# EAGLE schematic D1-Nixi-6csöves-z573m-V2 (EAGLE 6.3)
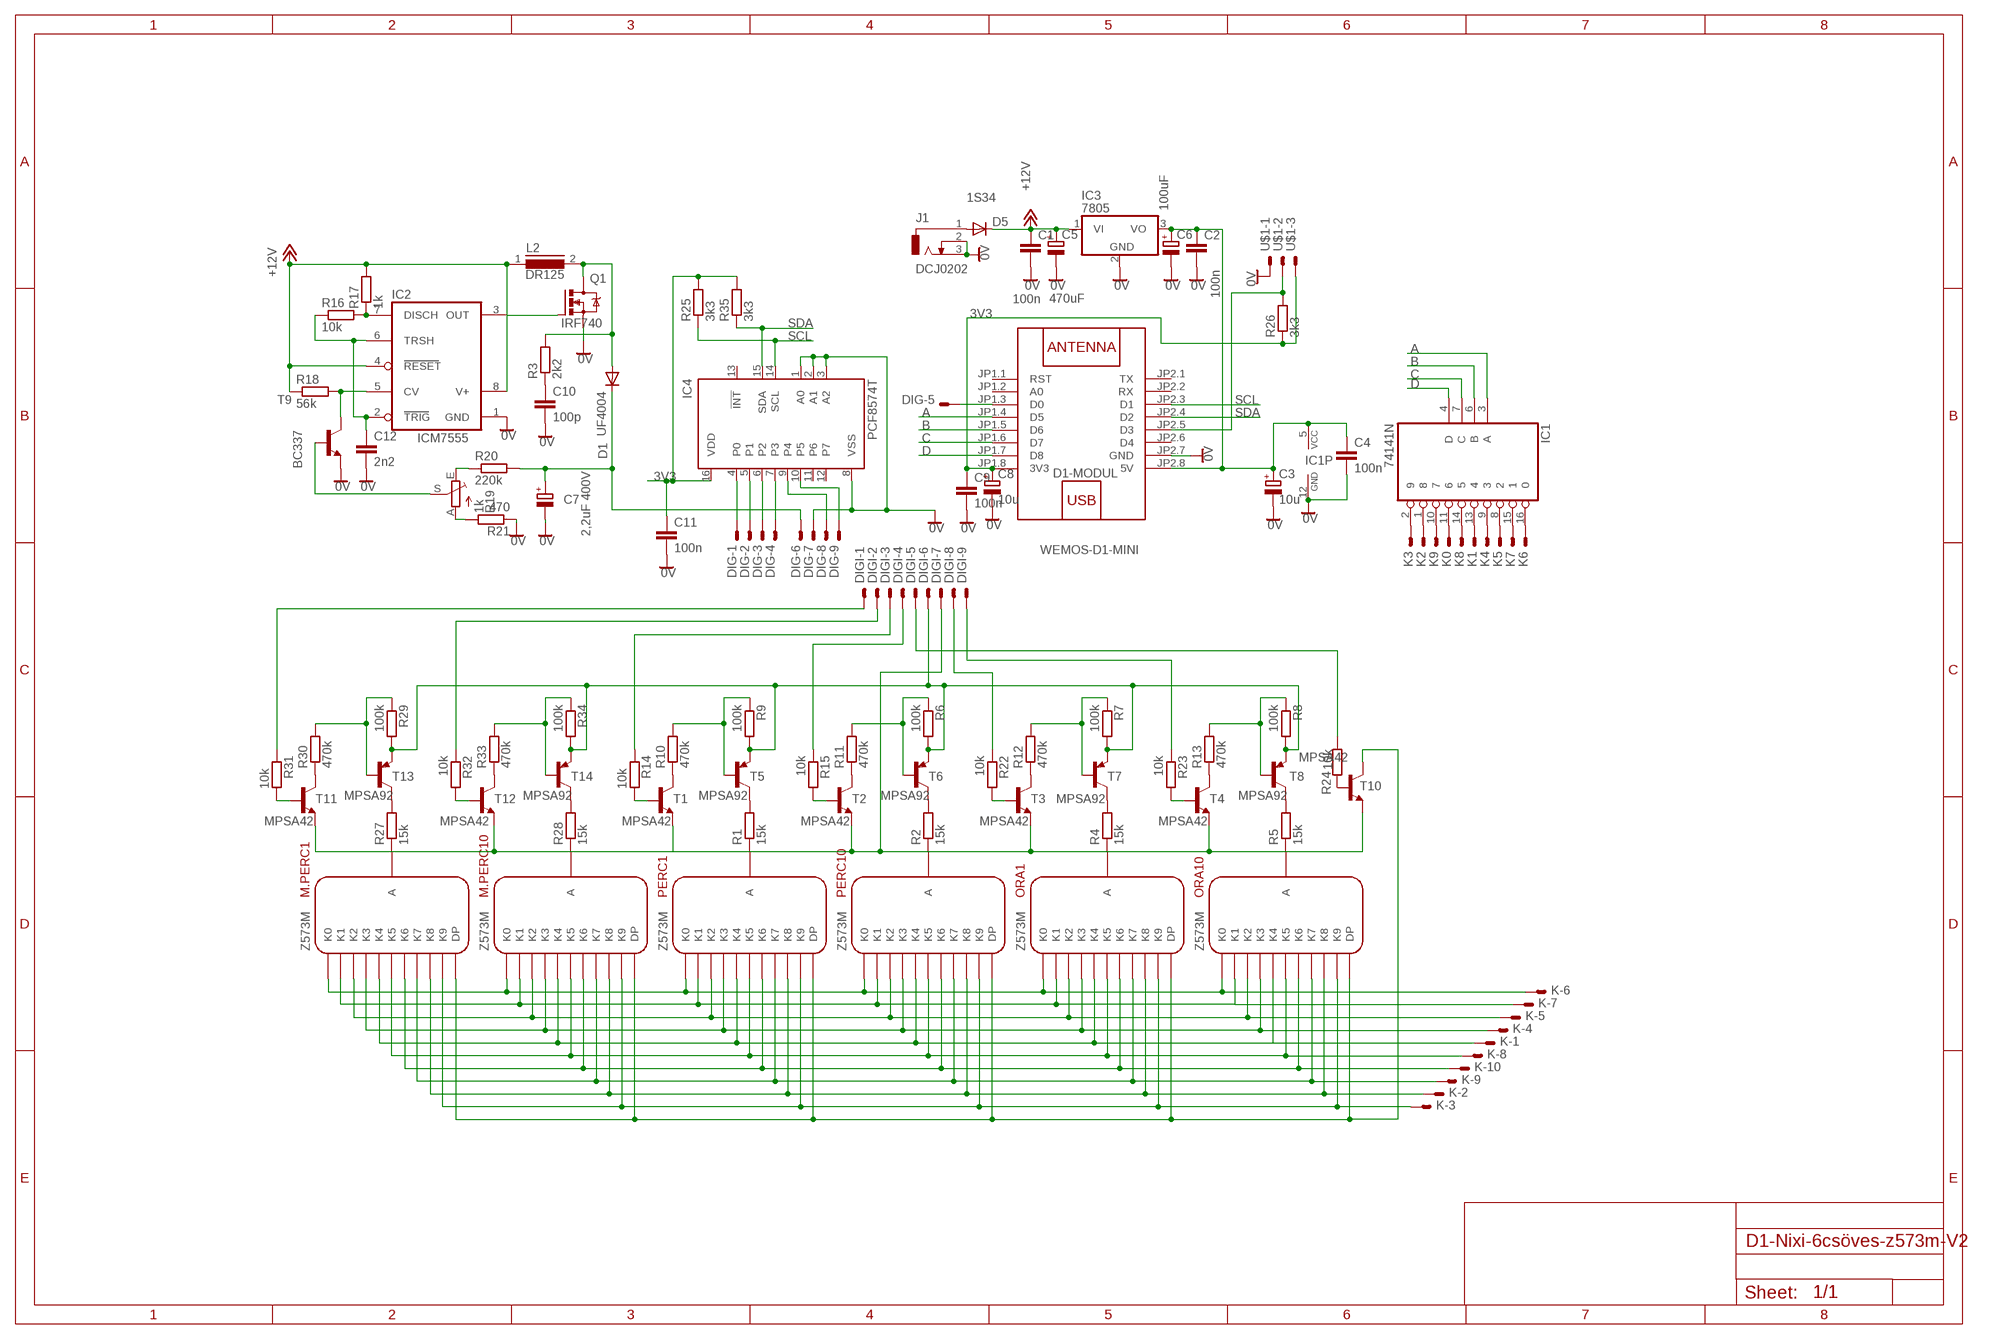
[diagram p0: schematic, sheet 1]

## Parts
C1  100n  C-EUC0603  [C0603]
C2  100n  C-EUC0603  [C0603]
C3  10u  CPOL-EUE2,5-6E  [E2,5-6E]
C4  100n  C-EUC0603  [C0603]
C5  470uF  CPOL-EUE5-10.5  [E5-10,5]
C6  100uF  CPOL-EUE3.5-8  [E3,5-8]
C7  2,2uF 400V  CPOL-EUE3.5-8  [E3,5-8]
C8  10u  CPOL-EUE2,5-6E  [E2,5-6E]
C9  100n  C-EUC0603  [C0603]
C10  100p  C-EU050-024X044  [C050-024X044]
C11  100n  C-EUC0603  [C0603]
C12  2n2  C-EUC0603  [C0603]
D1  UF4004  BA221  [DO35-10]
D1-MODUL  WEMOS-D1-MINI  [WEMOS-D1-MINI]
D5  1S34  DIODE-DO214AA  [DO214AA]
DIG  PAD9  [PAD9]
DIGI  PAD9  [PAD9]
IC1  74141N  [DIL16]
IC2  ICM7555  [DIL08]
IC3  7805  786TV  [TO220V]
IC4  PCF8574T  [SO16W]
J1  DCJ0202  [DCJ0202]
K  PAD25  [PAD25]
K0  PAD1  [PAD1]
K1  PAD1  [PAD1]
K2  PAD1  [PAD1]
K3  PAD1  [PAD1]
K4  PAD1  [PAD1]
K5  PAD1  [PAD1]
K6  PAD1  [PAD1]
K7  PAD1  [PAD1]
K8  PAD1  [PAD1]
K9  PAD1  [PAD1]
L2  DR125  [DR125]
M.PERC1  ora10  Z573SZ1  [Z573SZ1]
M.PERC10  Z573SZ1  [Z573SZ1]
ORA1  Z573SZ1  [Z573SZ1]
ORA10  Z573SZ1  [Z573SZ1]
PERC1  ora10  Z573SZ1  [Z573SZ1]
PERC10  Z573SZ1  [Z573SZ1]
Q1  IRF740  [TO220BV]
R1  15k  R-EU_0207/7  [0207/7]
R2  15k  R-EU_0207/7  [0207/7]
R3  2k2  R-EU_0204/7  [0204/7]
R4  15k  R-EU_0207/7  [0207/7]
R5  15k  R-EU_0207/7  [0207/7]
R6  100k  R-EU_0207/7  [0207/7]
R7  100k  R-EU_0207/7  [0207/7]
R8  100k  R-EU_0207/7  [0207/7]
R9  100k  R-EU_0207/7  [0207/7]
R10  470k  R-EU_0207/7  [0207/7]
R11  470k  R-EU_0207/7  [0207/7]
R12  470k  R-EU_0207/7  [0207/7]
R13  470k  R-EU_0207/7  [0207/7]
R14  10k  R-EU_0207/7  [0207/7]
R15  10k  R-EU_0207/7  [0207/7]
R16  10k  R-EU_R0603  [R0603]
R17  1k  R-EU_R0603  [R0603]
R18  56k  R-EU_R0603  [R0603]
R19  1k  TRIM_EU-CA6H  [CA6H]
R20  220k  R-EU_0204/7  [0204/7]
R21  470  R-EU_0204/7  [0204/7]
R22  10k  R-EU_0207/7  [0207/7]
R23  10k  R-EU_0207/7  [0207/7]
R24  10k  R-EU_0207/7  [0207/7]
R25  3k3  R-EU_R0603  [R0603]
R26  3k3  R-EU_R0603  [R0603]
R27  15k  R-EU_0207/7  [0207/7]
R28  15k  R-EU_0207/7  [0207/7]
R29  100k  R-EU_0207/7  [0207/7]
R30  470k  R-EU_0207/7  [0207/7]
R31  10k  R-EU_0207/7  [0207/7]
R32  10k  R-EU_0207/7  [0207/7]
R33  470k  R-EU_0207/7  [0207/7]
R34  100k  R-EU_0207/7  [0207/7]
R35  3k3  R-EU_R0603  [R0603]
T1  MPSA42  BC317-NPN-TO92-EBC  [TO92-EBC]
T2  MPSA42  BC317-NPN-TO92-EBC  [TO92-EBC]
T3  MPSA42  BC317-NPN-TO92-EBC  [TO92-EBC]
T4  MPSA42  BC317-NPN-TO92-EBC  [TO92-EBC]
T5  MPSA92  BC328-PNP-TO92-EBC  [TO92-EBC]
T6  MPSA92  BC328-PNP-TO92-EBC  [TO92-EBC]
T7  MPSA92  BC328-PNP-TO92-EBC  [TO92-EBC]
T8  MPSA92  BC328-PNP-TO92-EBC  [TO92-EBC]
T9  BC337  BC237-NPN-TO92-CBE  [TO92-CBE]
T10  MPSA42  BC317-NPN-TO92-EBC  [TO92-EBC]
T11  MPSA42  BC317-NPN-TO92-EBC  [TO92-EBC]
T12  MPSA42  BC317-NPN-TO92-EBC  [TO92-EBC]
T13  MPSA92  BC328-PNP-TO92-EBC  [TO92-EBC]
T14  MPSA92  BC328-PNP-TO92-EBC  [TO92-EBC]
U$1  PAD3  [PAD3]

## Nets
0V: C1.2 C2.2 C3.- C4.2 C5.- C6.- C7.- C8.- C9.2 C10.2 C11.2 C12.2 D1-MODUL.JP2.7(GND) DIG.P$7 IC1.12(GND) IC2.1(GND) IC3.2(GND) IC4.1(A0) IC4.2(A1) IC4.3(A2) IC4.8(VSS) J1.2 J1.3 Q1.S R21.1 T9.E U$1.P$1
3V3: C8.+ C9.1 C11.1 D1-MODUL.JP1.8(3V3) IC4.16(VDD) R25.2 R26.1 R35.2 U$1.P$3
+12V: C1.1 C5.+ D5.C IC2.4(RESET) IC2.8(V+) IC3.1(VI) L2.1 R17.2 R18.1
A: D1-MODUL.JP1.4(D5) IC1.3(A)
B: D1-MODUL.JP1.5(D6) IC1.6(B)
C: D1-MODUL.JP1.6(D7) IC1.7(C)
D: D1-MODUL.JP1.7(D8) IC1.4(D)
GND: DIGI.P$7 T1.E T2.E T3.E T4.E T10.E
GND1: T11.E T12.E
N$1: DIG.P$9 IC4.10(P5)
N$2: DIG.P$4 IC4.7(P3)
N$3: DIG.P$8 IC4.9(P4)
N$4: DIG.P$1 IC4.4(P0)
N$5: DIG.P$2 IC4.5(P1)
N$6: DIG.P$3 IC4.6(P2)
N$7: IC1.16 K6.1(S)
N$8: IC1.10 K9.1(S)
N$9: IC1.15 K7.1(S)
N$10: PERC1.A R1.1
N$11: PERC10.A R2.1
N$12: ORA1.A R4.1
N$13: ORA10.A R5.1
N$14: R1.2 T5.C
N$15: R2.2 T6.C
N$16: R4.2 T7.C
N$17: R5.2 T8.C
N$18: R19.E R20.1
N$19: R10.1 T1.C
N$20: R19.A R21.2
N$21: R9.1 R10.2 T5.B
N$22: IC2.3(OUT) Q1.G
N$23: IC2.7(DISCH) R16.2 R17.1
N$24: C12.1 IC2.2(TRIG) IC2.6(TRSH) R16.1
N$25: R6.1 R11.2 T6.B
N$26: IC2.5(CV) R18.2 T9.C
N$27: C10.1 R3.1
N$28: C7.+ D1.C DIG.P$6 R20.2
N$29: R7.1 R12.2 T7.B
N$30: R8.1 R13.2 T8.B
N$31: R11.1 T2.C
N$32: R12.1 T3.C
N$33: R13.1 T4.C
N$34: R14.2 T1.B
N$35: R15.2 T2.B
N$36: R22.2 T3.B
N$37: R23.2 T4.B
N$38: R24.2 T10.B
N$39: DIGI.P$6 R6.2 R7.2 R8.2 R9.2 R29.2 R34.2 T5.E T6.E T7.E T8.E T13.E T14.E
N$40: DIGI.P$3 R14.1
N$41: DIGI.P$4 R15.1
N$42: K.P$6 M.PERC1.K0 M.PERC10.K0 ORA1.K0 ORA10.K0 PERC1.K0 PERC10.K0
N$44: D1.A L2.2 Q1.D R3.2
N$45: K.P$7 M.PERC1.K1 M.PERC10.K1 ORA1.K1 ORA10.K1 PERC1.K1 PERC10.K1
N$46: IC1.8 K5.1(S)
N$47: IC1.9 K4.1(S)
N$48: IC1.2 K3.1(S)
N$49: IC1.1 K2.1(S)
N$50: IC1.13 K1.1(S)
N$51: IC1.14 K8.1(S)
N$52: IC1.11 K0.1(S)
N$53: D1-MODUL.JP1.3(D0) DIG.P$5
N$56: K.P$5 M.PERC1.K2 M.PERC10.K2 ORA1.K2 ORA10.K2 PERC1.K2 PERC10.K2
N$57: K.P$4 M.PERC1.K3 M.PERC10.K3 ORA1.K3 ORA10.K3 PERC1.K3 PERC10.K3
N$58: K.P$1 M.PERC1.K4 M.PERC10.K4 ORA1.K4 ORA10.K4 PERC1.K4 PERC10.K4
N$59: K.P$8 M.PERC1.K5 M.PERC10.K5 ORA1.K5 ORA10.K5 PERC1.K5 PERC10.K5
N$60: D5.A J1.1
N$61: K.P$10 M.PERC1.K6 M.PERC10.K6 ORA1.K6 ORA10.K6 PERC1.K6 PERC10.K6
N$62: K.P$9 M.PERC1.K7 M.PERC10.K7 ORA1.K7 ORA10.K7 PERC1.K7 PERC10.K7
N$63: K.P$2 M.PERC1.K8 M.PERC10.K8 ORA1.K8 ORA10.K8 PERC1.K8 PERC10.K8
N$64: K.P$3 M.PERC1.K9 M.PERC10.K9 ORA1.K9 ORA10.K9 PERC1.K9 PERC10.K9
N$67: DIGI.P$8 R22.1
N$68: DIGI.P$9 R23.1
N$69: DIGI.P$5 R24.1
N$71: C2.1 C3.+ C4.1 C6.+ D1-MODUL.JP2.8(5V) IC1.5(VCC) IC3.3(VO)
N$80: D1-MODUL.JP2.5(D3) R26.2 U$1.P$2
N$82: M.PERC1.A R27.1
N$83: M.PERC10.A R28.1
N$84: R27.2 T13.C
N$85: R28.2 T14.C
N$86: R30.1 T11.C
N$87: R31.2 T11.B
N$88: R32.2 T12.B
N$90: R29.1 R30.2 T13.B
N$91: R33.2 R34.1 T14.B
N$102: DIGI.P$1 R31.1
N$103: DIGI.P$2 R32.1
N$104: R33.1 T12.C
N$105: M.PERC1.DP M.PERC10.DP ORA1.DP ORA10.DP PERC1.DP PERC10.DP T10.C
N$119: R19.S T9.B
SCL: D1-MODUL.JP2.3(D1) IC4.14(SCL) R25.1
SDA: D1-MODUL.JP2.4(D2) IC4.15(SDA) R35.1
Unconnected: D1-MODUL.JP1.1(RST) D1-MODUL.JP1.2(A0) D1-MODUL.JP2.1(TX) D1-MODUL.JP2.2(RX) D1-MODUL.JP2.6(D4) IC4.11(P6) IC4.12(P7) IC4.13(!INT)

## Library data of the parts
C1 C2 C4 C9-C12 = resistor:C-EU: CAPACITOR, European symbol
C3 C5-C8 = resistor:CPOL-EU: POLARIZED CAPACITOR, European symbol
D1 = diode:BA221: DIODE high speed (Philips)
D1-MODUL = diy-modules:WEMOS-D1-MINI: WEMOS D1 mini: Mini Wi-Fi Board based on ESP-8266 device More details can be found here: https://www.wemos.cc/product/d1-mini.html Click here to find device on ebay.com <http://www.ebay.com/sch/wemos+d1+mini+nodemcu>
D5 = diode:DIODE-: DIODE
DIG DIGI = tuskesor:PAD9
IC1 = 74xx-eu:74*141: BCD to decimal DECODER/DRIVER
IC2 = maxim1:ICM7555: TIMER; MF: MAXIM; MPN: ICM7555IPA+; OC_FARNELL: 9663762; OC_NEWARK: 68K4387
IC3 = linear:78*: Positive VOLTAGE REGULATOR Source: http://cache.national.com/ds/LM/LM78L05.pdf http://www.fairchildsemi.com/ds/LM/LM7805.pdf
IC4 = micro-philips:PCF8574: I2C-Bus Remote 8-bit I/O expander http://www.semiconductors.philips.com/acrobat_download/datasheets/PCF8574_4.pdf; MPN: PCF8574T/3,512; OC_FARNELL: 1201255; OC_NEWARK: 70R6870
J1 = con-jack:DCJ0202: DC POWER JACK Source: DCJ0202.pdf; OC_FARNELL: unknown; OC_NEWARK: unknown
K = tuskesor:PAD25
K0 K1-K9 = tuskesor:PAD1
L2 = inductors:DR125: High Power Density, High Efficiency, Shielded Inductors Source: coiltronics_dr_series.pdf
M.PERC1 M.PERC10 ORA1 ORA10 PERC1 PERC10 =    Z573M:Z573SZ1
Q1 = transistor-power:IRF740: N-CHANNEL MOS FET
R1-R18 R20-R35 = resistor:R-EU_: RESISTOR, European symbol
R19 = pot:TRIM_EU-: POTENTIOMETER
T1-T4 T9-T12 = transistor:*-NPN-: NPN Transistror BF959 corrected 2008.03.06
T5-T8 T13 T14 = transistor:*-PNP-: PNP Transistror
U$1 = tuskesor:PAD3